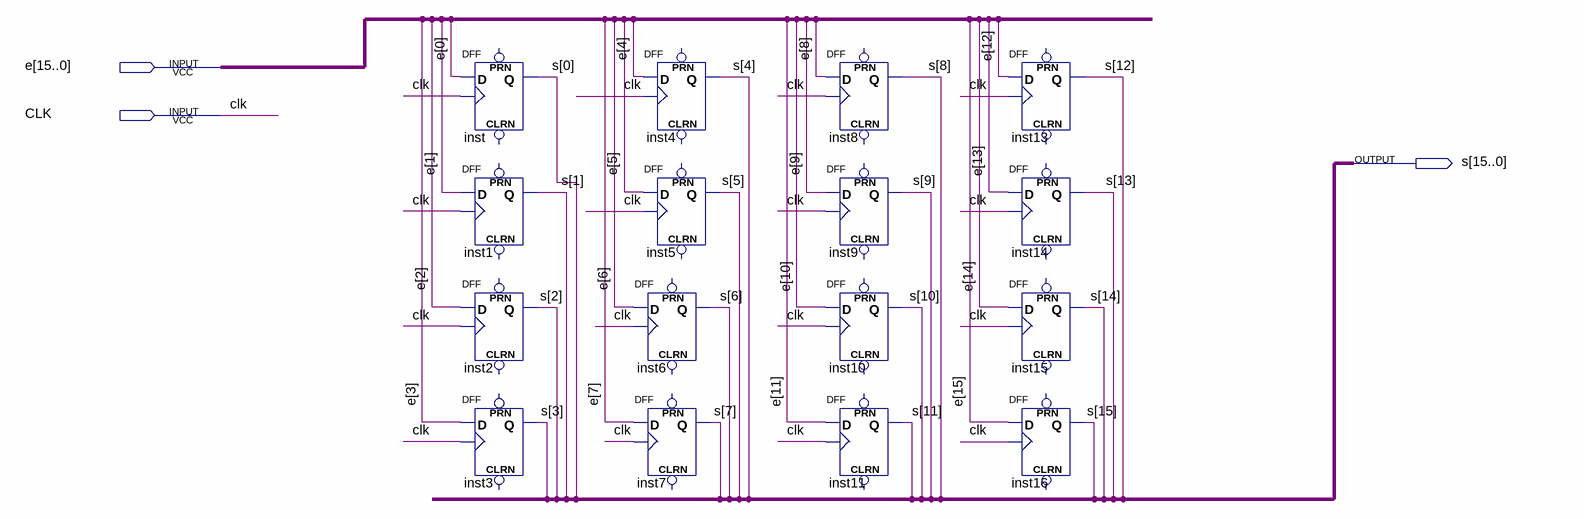
[diagram p0: schematic sheet]
// Quartus schematic Registro_16_b_in.bdf as structural Verilog: 16 symbols, 3 pins
module Registro_16_b_in (
  input  [15:0] e,
  input  CLK,
  output [15:0] s
);

  DFF inst (.CLK(CLK), .D(e[0]), .Q(s[0]));  // open: CLRN, PRN
  DFF inst1 (.CLK(CLK), .D(e[1]), .Q(s[1]));  // open: CLRN, PRN
  DFF inst2 (.CLK(CLK), .D(e[2]), .Q(s[2]));  // open: CLRN, PRN
  DFF inst3 (.CLK(CLK), .D(e[3]), .Q(s[3]));  // open: CLRN, PRN
  DFF inst4 (.CLK(CLK), .D(e[4]), .Q(s[4]));  // open: CLRN, PRN
  DFF inst5 (.CLK(CLK), .D(e[5]), .Q(s[5]));  // open: CLRN, PRN
  DFF inst6 (.CLK(CLK), .D(e[6]), .Q(s[6]));  // open: CLRN, PRN
  DFF inst7 (.CLK(CLK), .D(e[7]), .Q(s[7]));  // open: CLRN, PRN
  DFF inst8 (.CLK(CLK), .D(e[8]), .Q(s[8]));  // open: CLRN, PRN
  DFF inst9 (.CLK(CLK), .D(e[9]), .Q(s[9]));  // open: CLRN, PRN
  DFF inst10 (.CLK(CLK), .D(e[10]), .Q(s[10]));  // open: CLRN, PRN
  DFF inst11 (.CLK(CLK), .D(e[11]), .Q(s[11]));  // open: CLRN, PRN
  DFF inst13 (.CLK(CLK), .D(e[12]), .Q(s[12]));  // open: CLRN, PRN
  DFF inst14 (.CLK(CLK), .D(e[13]), .Q(s[13]));  // open: CLRN, PRN
  DFF inst15 (.CLK(CLK), .D(e[14]), .Q(s[14]));  // open: CLRN, PRN
  DFF inst16 (.CLK(CLK), .D(e[15]), .Q(s[15]));  // open: CLRN, PRN
endmodule
